# EAGLE board Max10-Brd-v1 (EAGLE 9.2.2), part 1 of 2
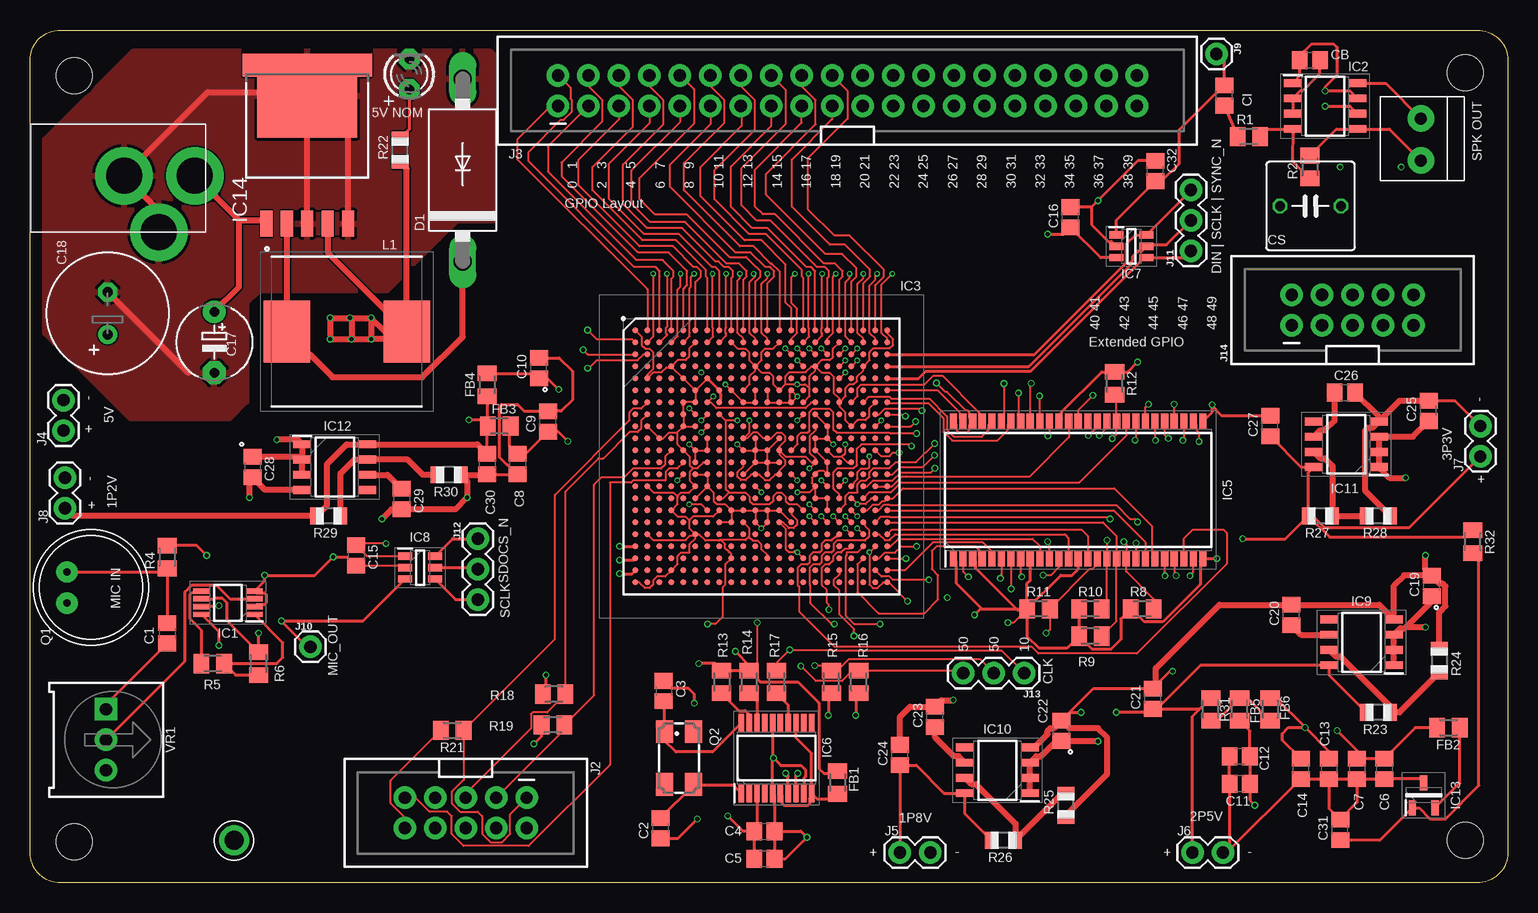
[diagram p7: board, top side]
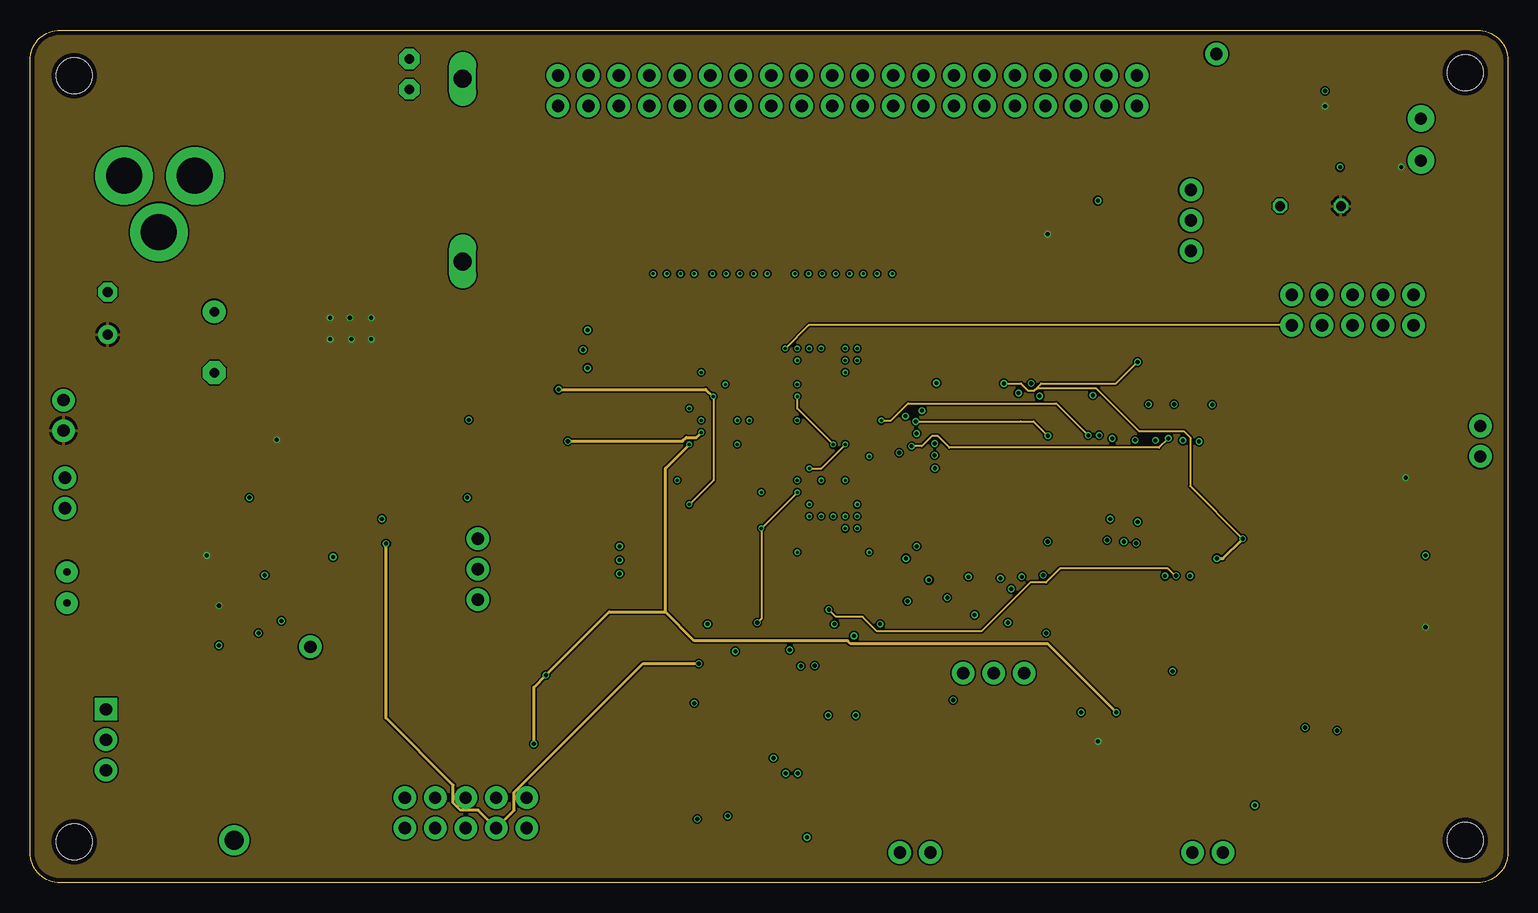
[diagram p8: board, inner layer Route2]
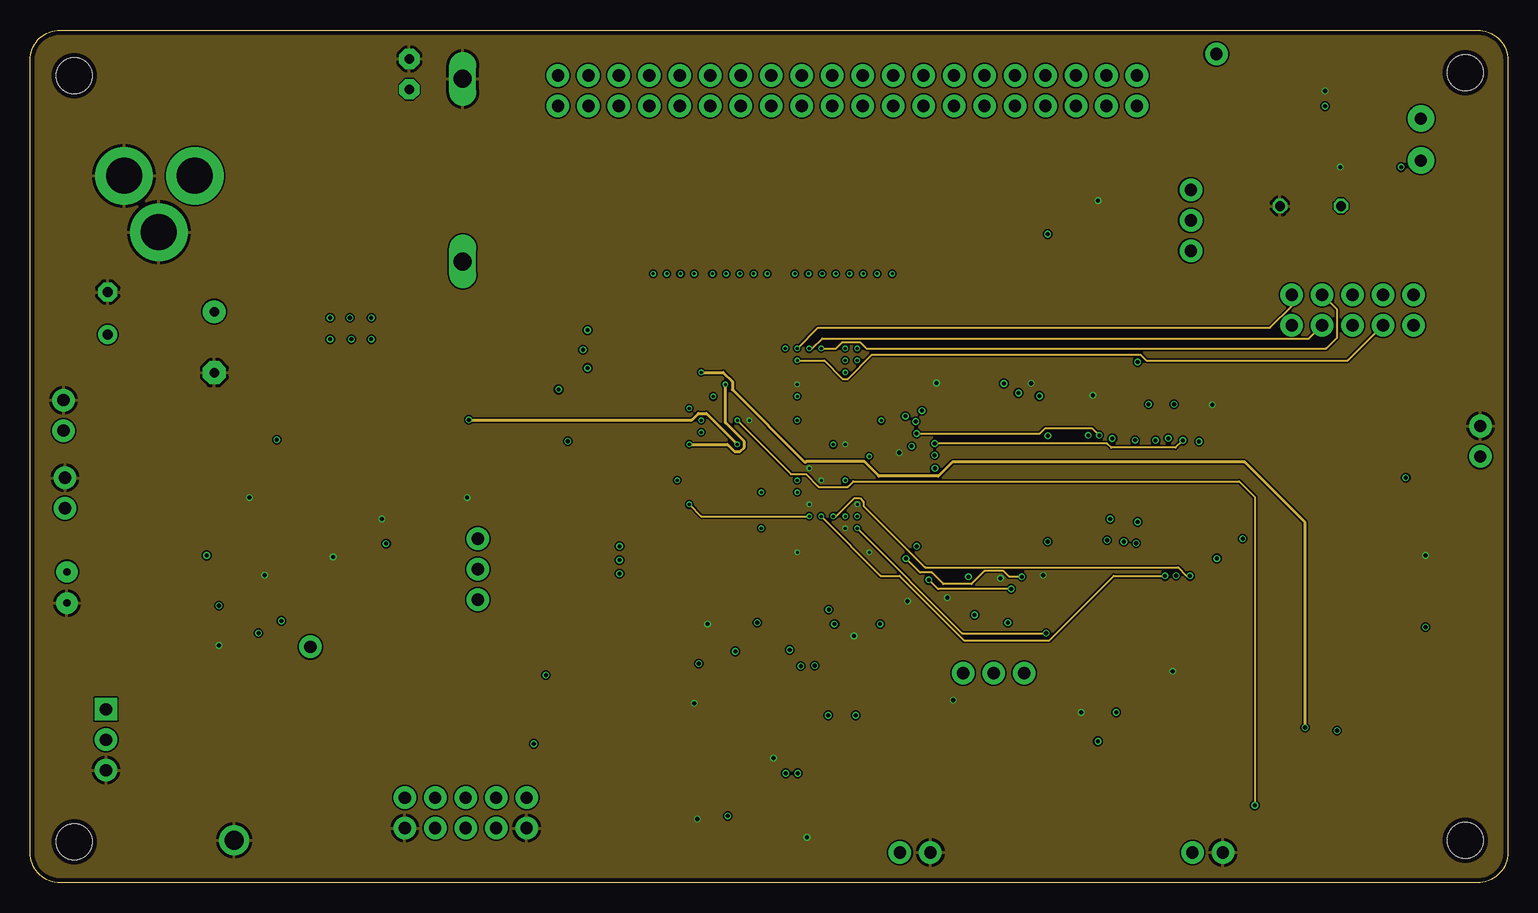
[diagram p9: board, inner layer Route15]
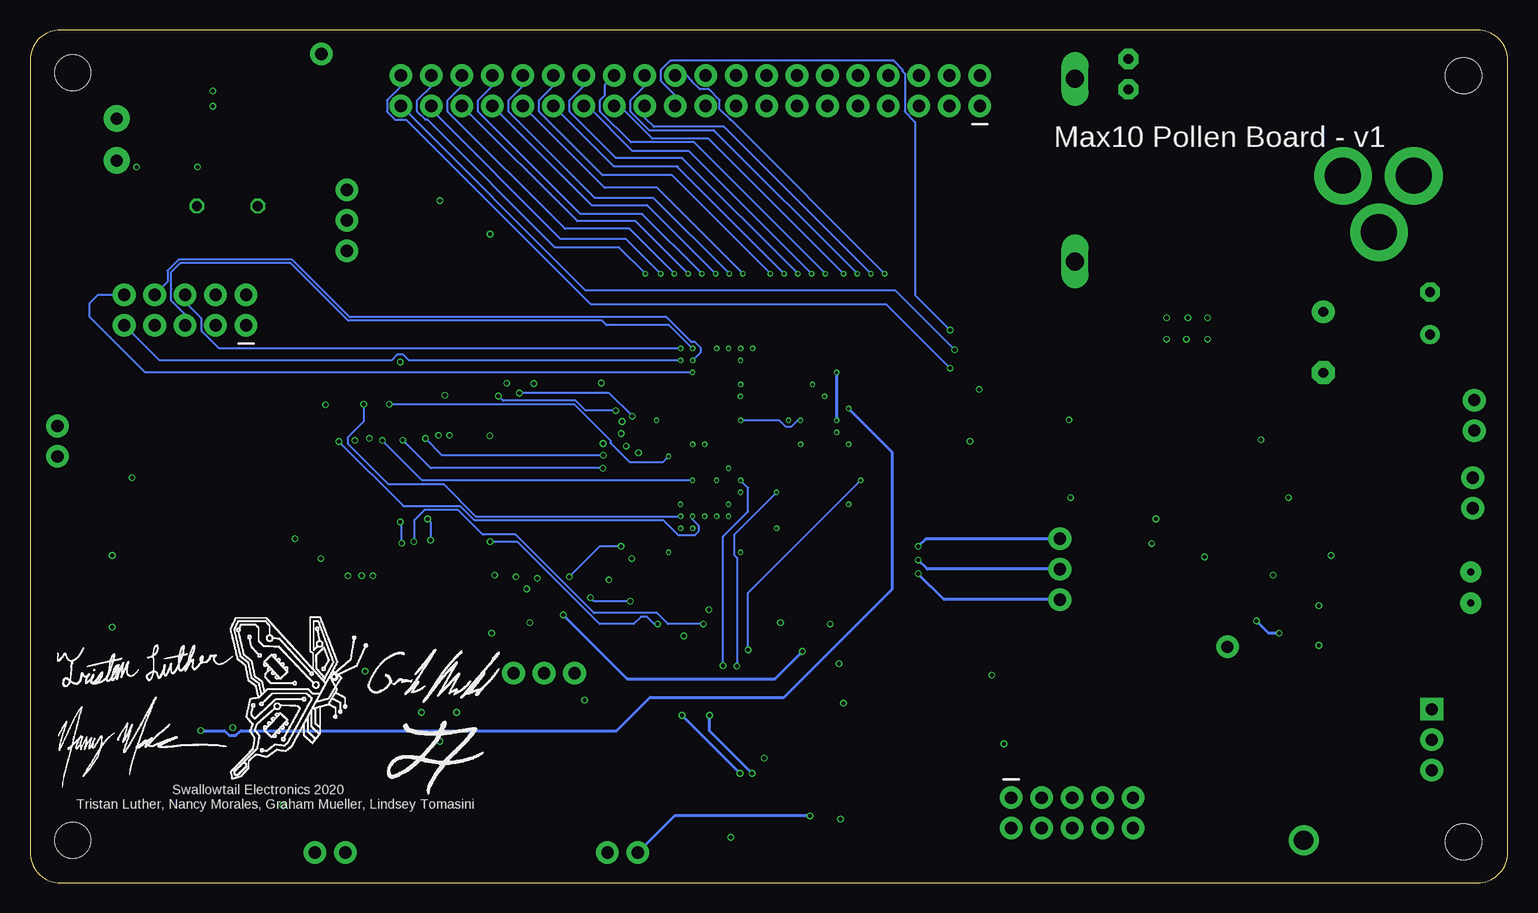
[diagram p10: board, bottom side, seen from below]

Size 123.19 x 71.12 mm. Coordinates in mm from the lower left corner, seen from the top.
Outline: 2.54,71.12 120.65,71.12 arc-90 123.19,68.58 123.19,2.54 arc-90 120.65,0 2.54,0 arc-90 0,2.54 0,68.58 arc-90 2.54,71.12
Copper layers (1*2*15*16): Top 0.035559375mm / dielectric 0.17018125mm / Route2 0.01778125mm / dielectric 47mil / Route15 0.01778125mm / dielectric 0.17018125mm / Bottom 0.035559375mm
Design rules "oshpark-4layer": minimum track width 5mil, minimum drill 10mil, track to track 5mil, track to pad 5mil, pad to pad 5mil, via to via 5mil, smd to smd 5mil, copper to edge 15mil, drill to drill 6mil, minimum pad ring 4mil, minimum via ring 4mil, stop-mask expansion 2.5mil, vias tented up to drill 0mil, thermal gap 10mil
Holes 3 mm at 119.63,3.56 119.63,67.56 3.68,3.43 3.68,67.31

## Footprints (pad centres in the part's own frame; a part is rotated, then mirrored left to right if it is on the bottom)
C0805 = smd 1.3 x 1.5: 1 -0.85,0; 2 0.85,0
E5-6 = drill 0.813 pad 1.905: + -2.54,0 | drill 0.813 pad 1.905 octagon: - 2.54,0
E3,5-10 = drill 0.813 pad 1.6: + -1.778,0 | drill 0.813 pad 1.6 octagon: - 1.778,0
C050-075X075 = drill 0.813 octagon: 1 -2.54,0; 2 2.54,0
DO201-15 = drill 1.499 long: A 7.62,0; C -7.62,0
M0805 = smd 1.3 x 1.6: 1 -0.95,0; 2 0.95,0
SOP65P490X110-8N = smd 1.4 x 0.45: 1 -2.2,0.975; 2 -2.2,0.325; 3 -2.2,-0.325; 4 -2.2,-0.975; 5 2.2,-0.975; 6 2.2,-0.325; 7 2.2,0.325; 8 2.2,0.975
SOIC127P600X175-8N = smd 1.5 x 0.65: 1 -2.7,1.905; 2 -2.7,0.635; 3 -2.7,-0.635; 4 -2.7,-1.905; 5 2.7,-1.905; 6 2.7,-0.635; 7 2.7,0.635; 8 2.7,1.905
BGA484C100P22X22_2300X2300X200 = smd 0.5 x 0.5: A1 -10.5,10.5; A2 -9.5,10.5; A3 -8.5,10.5; A4 -7.5,10.5; A5 -6.5,10.5; A6 -5.5,10.5; A7 -4.5,10.5; A8 -3.5,10.5; A9 -2.5,10.5; A10 -1.5,10.5; A11 -0.5,10.5; A12 0.5,10.5; A13 1.5,10.5; A14 2.5,10.5; A15 3.5,10.5; A16 4.5,10.5; A17 5.5,10.5; A18 6.5,10.5; A19 7.5,10.5; A20 8.5,10.5; A21 9.5,10.5; A22 10.5,10.5; AA1 -10.5,-9.5; AA2 -9.5,-9.5; AA3 -8.5,-9.5; AA4 -7.5,-9.5; AA5 -6.5,-9.5; AA6 -5.5,-9.5; AA7 -4.5,-9.5; AA8 -3.5,-9.5; AA9 -2.5,-9.5; AA10 -1.5,-9.5; AA11 -0.5,-9.5; AA12 0.5,-9.5; AA13 1.5,-9.5; AA14 2.5,-9.5; AA15 3.5,-9.5; AA16 4.5,-9.5; AA17 5.5,-9.5; AA18 6.5,-9.5; AA19 7.5,-9.5; AA20 8.5,-9.5; AA21 9.5,-9.5; AA22 10.5,-9.5; AB1 -10.5,-10.5; AB2 -9.5,-10.5; AB3 -8.5,-10.5; AB4 -7.5,-10.5; AB5 -6.5,-10.5; AB6 -5.5,-10.5; AB7 -4.5,-10.5; AB8 -3.5,-10.5; AB9 -2.5,-10.5; AB10 -1.5,-10.5; AB11 -0.5,-10.5; AB12 0.5,-10.5; AB13 1.5,-10.5; AB14 2.5,-10.5; AB15 3.5,-10.5; AB16 4.5,-10.5; AB17 5.5,-10.5; AB18 6.5,-10.5; AB19 7.5,-10.5; AB20 8.5,-10.5; AB21 9.5,-10.5; AB22 10.5,-10.5; B1 -10.5,9.5; B2 -9.5,9.5; B3 -8.5,9.5; B4 -7.5,9.5; B5 -6.5,9.5; B6 -5.5,9.5; B7 -4.5,9.5; B8 -3.5,9.5; B9 -2.5,9.5; B10 -1.5,9.5; B11 -0.5,9.5; B12 0.5,9.5; B13 1.5,9.5; B14 2.5,9.5; B15 3.5,9.5; B16 4.5,9.5; B17 5.5,9.5; B18 6.5,9.5; B19 7.5,9.5; B20 8.5,9.5; B21 9.5,9.5; B22 10.5,9.5; C1 -10.5,8.5; C2 -9.5,8.5; C3 -8.5,8.5; C4 -7.5,8.5; C5 -6.5,8.5; C6 -5.5,8.5; C7 -4.5,8.5; C8 -3.5,8.5; C9 -2.5,8.5; C10 -1.5,8.5; C11 -0.5,8.5; C12 0.5,8.5; C13 1.5,8.5; C14 2.5,8.5; C15 3.5,8.5; C16 4.5,8.5; C17 5.5,8.5; C18 6.5,8.5; C19 7.5,8.5; C20 8.5,8.5; C21 9.5,8.5; C22 10.5,8.5; D1 -10.5,7.5; D2 -9.5,7.5; D3 -8.5,7.5; D4 -7.5,7.5; D5 -6.5,7.5; D6 -5.5,7.5; D7 -4.5,7.5; D8 -3.5,7.5; D9 -2.5,7.5; D10 -1.5,7.5; D11 -0.5,7.5; D12 0.5,7.5; D13 1.5,7.5; D14 2.5,7.5; D15 3.5,7.5; D16 4.5,7.5; D17 5.5,7.5; D18 6.5,7.5; D19 7.5,7.5; D20 8.5,7.5; D21 9.5,7.5; D22 10.5,7.5; E1 -10.5,6.5; E2 -9.5,6.5; E3 -8.5,6.5; E4 -7.5,6.5; E5 -6.5,6.5; E6 -5.5,6.5; E7 -4.5,6.5; E8 -3.5,6.5; E9 -2.5,6.5; E10 -1.5,6.5; E11 -0.5,6.5; E12 0.5,6.5; E13 1.5,6.5; E14 2.5,6.5; E15 3.5,6.5; E16 4.5,6.5; E17 5.5,6.5; E18 6.5,6.5; E19 7.5,6.5; E20 8.5,6.5; E21 9.5,6.5; E22 10.5,6.5; F1 -10.5,5.5; F2 -9.5,5.5; F3 -8.5,5.5; F4 -7.5,5.5; F5 -6.5,5.5; F6 -5.5,5.5; F7 -4.5,5.5; F8 -3.5,5.5; F9 -2.5,5.5; F10 -1.5,5.5; F11 -0.5,5.5; F12 0.5,5.5; F13 1.5,5.5; F14 2.5,5.5; F15 3.5,5.5; F16 4.5,5.5; F17 5.5,5.5; F18 6.5,5.5; F19 7.5,5.5; F20 8.5,5.5; F21 9.5,5.5; F22 10.5,5.5; G1 -10.5,4.5; G2 -9.5,4.5; G3 -8.5,4.5; G4 -7.5,4.5; G5 -6.5,4.5; G6 -5.5,4.5; G7 -4.5,4.5; G8 -3.5,4.5; G9 -2.5,4.5; G10 -1.5,4.5; G11 -0.5,4.5; G12 0.5,4.5; G13 1.5,4.5; G14 2.5,4.5; G15 3.5,4.5; G16 4.5,4.5; G17 5.5,4.5; G18 6.5,4.5; G19 7.5,4.5; G20 8.5,4.5; G21 9.5,4.5; G22 10.5,4.5; H1 -10.5,3.5; H2 -9.5,3.5; H3 -8.5,3.5; H4 -7.5,3.5; H5 -6.5,3.5; H6 -5.5,3.5; H7 -4.5,3.5; H8 -3.5,3.5; H9 -2.5,3.5; H10 -1.5,3.5; H11 -0.5,3.5; H12 0.5,3.5; H13 1.5,3.5; H14 2.5,3.5; H15 3.5,3.5; H16 4.5,3.5; H17 5.5,3.5; H18 6.5,3.5; H19 7.5,3.5; H20 8.5,3.5; H21 9.5,3.5; H22 10.5,3.5; J1 -10.5,2.5; J2 -9.5,2.5; J3 -8.5,2.5; J4 -7.5,2.5; J5 -6.5,2.5; J6 -5.5,2.5; J7 -4.5,2.5; J8 -3.5,2.5; J9 -2.5,2.5; J10 -1.5,2.5; J11 -0.5,2.5; J12 0.5,2.5; J13 1.5,2.5; J14 2.5,2.5; J15 3.5,2.5; J16 4.5,2.5; J17 5.5,2.5; J18 6.5,2.5; J19 7.5,2.5; J20 8.5,2.5; J21 9.5,2.5; J22 10.5,2.5; K1 -10.5,1.5; K2 -9.5,1.5; K3 -8.5,1.5; K4 -7.5,1.5; K5 -6.5,1.5; K6 -5.5,1.5; K7 -4.5,1.5; K8 -3.5,1.5; K9 -2.5,1.5; K10 -1.5,1.5; K11 -0.5,1.5; K12 0.5,1.5; K13 1.5,1.5; K14 2.5,1.5; K15 3.5,1.5; K16 4.5,1.5; K17 5.5,1.5; K18 6.5,1.5; K19 7.5,1.5; K20 8.5,1.5; K21 9.5,1.5; K22 10.5,1.5; L1 -10.5,0.5; L2 -9.5,0.5; L3 -8.5,0.5; L4 -7.5,0.5; L5 -6.5,0.5; L6 -5.5,0.5; L7 -4.5,0.5; L8 -3.5,0.5; L9 -2.5,0.5; L10 -1.5,0.5; L11 -0.5,0.5; L12 0.5,0.5; L13 1.5,0.5; L14 2.5,0.5; L15 3.5,0.5; L16 4.5,0.5; L17 5.5,0.5; L18 6.5,0.5; L19 7.5,0.5; L20 8.5,0.5; L21 9.5,0.5; L22 10.5,0.5; M1 -10.5,-0.5; M2 -9.5,-0.5; M3 -8.5,-0.5; M4 -7.5,-0.5; M5 -6.5,-0.5; M6 -5.5,-0.5; M7 -4.5,-0.5; M8 -3.5,-0.5; M9 -2.5,-0.5; M10 -1.5,-0.5; M11 -0.5,-0.5; M12 0.5,-0.5; M13 1.5,-0.5; M14 2.5,-0.5; M15 3.5,-0.5; M16 4.5,-0.5; M17 5.5,-0.5; M18 6.5,-0.5; M19 7.5,-0.5; M20 8.5,-0.5; M21 9.5,-0.5; M22 10.5,-0.5; N1 -10.5,-1.5; N2 -9.5,-1.5; N3 -8.5,-1.5; N4 -7.5,-1.5; N5 -6.5,-1.5; N6 -5.5,-1.5; N7 -4.5,-1.5; N8 -3.5,-1.5; N9 -2.5,-1.5; N10 -1.5,-1.5; N11 -0.5,-1.5; N12 0.5,-1.5; N13 1.5,-1.5; N14 2.5,-1.5; N15 3.5,-1.5; N16 4.5,-1.5; N17 5.5,-1.5; N18 6.5,-1.5; N19 7.5,-1.5; N20 8.5,-1.5; N21 9.5,-1.5; N22 10.5,-1.5; P1 -10.5,-2.5; P2 -9.5,-2.5; P3 -8.5,-2.5; P4 -7.5,-2.5; P5 -6.5,-2.5; P6 -5.5,-2.5; P7 -4.5,-2.5; P8 -3.5,-2.5; P9 -2.5,-2.5; P10 -1.5,-2.5; P11 -0.5,-2.5; P12 0.5,-2.5; P13 1.5,-2.5; P14 2.5,-2.5; P15 3.5,-2.5; P16 4.5,-2.5; P17 5.5,-2.5; P18 6.5,-2.5; P19 7.5,-2.5; P20 8.5,-2.5; P21 9.5,-2.5; P22 10.5,-2.5; R1 -10.5,-3.5; R2 -9.5,-3.5; R3 -8.5,-3.5; R4 -7.5,-3.5; R5 -6.5,-3.5; R6 -5.5,-3.5; R7 -4.5,-3.5; R8 -3.5,-3.5; R9 -2.5,-3.5; R10 -1.5,-3.5; R11 -0.5,-3.5; R12 0.5,-3.5; R13 1.5,-3.5; R14 2.5,-3.5; R15 3.5,-3.5; R16 4.5,-3.5; R17 5.5,-3.5; R18 6.5,-3.5; R19 7.5,-3.5; R20 8.5,-3.5; R21 9.5,-3.5; R22 10.5,-3.5; T1 -10.5,-4.5; T2 -9.5,-4.5; T3 -8.5,-4.5; T4 -7.5,-4.5; T5 -6.5,-4.5; T6 -5.5,-4.5; T7 -4.5,-4.5; T8 -3.5,-4.5; T9 -2.5,-4.5; T10 -1.5,-4.5; T11 -0.5,-4.5; T12 0.5,-4.5; T13 1.5,-4.5; T14 2.5,-4.5; T15 3.5,-4.5; T16 4.5,-4.5; T17 5.5,-4.5; T18 6.5,-4.5; T19 7.5,-4.5; T20 8.5,-4.5; T21 9.5,-4.5; T22 10.5,-4.5; U1 -10.5,-5.5; U2 -9.5,-5.5; U3 -8.5,-5.5; U4 -7.5,-5.5; U5 -6.5,-5.5; U6 -5.5,-5.5; U7 -4.5,-5.5; U8 -3.5,-5.5; U9 -2.5,-5.5; U10 -1.5,-5.5; U11 -0.5,-5.5; U12 0.5,-5.5; U13 1.5,-5.5; U14 2.5,-5.5; U15 3.5,-5.5; U16 4.5,-5.5; U17 5.5,-5.5; U18 6.5,-5.5; U19 7.5,-5.5; U20 8.5,-5.5; U21 9.5,-5.5; U22 10.5,-5.5; V1 -10.5,-6.5; V2 -9.5,-6.5; V3 -8.5,-6.5; V4 -7.5,-6.5; V5 -6.5,-6.5; V6 -5.5,-6.5; V7 -4.5,-6.5; V8 -3.5,-6.5; V9 -2.5,-6.5; V10 -1.5,-6.5; V11 -0.5,-6.5; V12 0.5,-6.5; V13 1.5,-6.5; V14 2.5,-6.5; V15 3.5,-6.5; V16 4.5,-6.5; V17 5.5,-6.5; V18 6.5,-6.5; V19 7.5,-6.5; V20 8.5,-6.5; V21 9.5,-6.5; V22 10.5,-6.5; W1 -10.5,-7.5; W2 -9.5,-7.5; W3 -8.5,-7.5; W4 -7.5,-7.5; W5 -6.5,-7.5; W6 -5.5,-7.5; W7 -4.5,-7.5; W8 -3.5,-7.5; W9 -2.5,-7.5; W10 -1.5,-7.5; W11 -0.5,-7.5; W12 0.5,-7.5; W13 1.5,-7.5; W14 2.5,-7.5; W15 3.5,-7.5; W16 4.5,-7.5; W17 5.5,-7.5; W18 6.5,-7.5; W19 7.5,-7.5; W20 8.5,-7.5; W21 9.5,-7.5; W22 10.5,-7.5; Y1 -10.5,-8.5; Y2 -9.5,-8.5; Y3 -8.5,-8.5; Y4 -7.5,-8.5; Y5 -6.5,-8.5; Y6 -5.5,-8.5; Y7 -4.5,-8.5; Y8 -3.5,-8.5; Y9 -2.5,-8.5; Y10 -1.5,-8.5; Y11 -0.5,-8.5; Y12 0.5,-8.5; Y13 1.5,-8.5; Y14 2.5,-8.5; Y15 3.5,-8.5; Y16 4.5,-8.5; Y17 5.5,-8.5; Y18 6.5,-8.5; Y19 7.5,-8.5; Y20 8.5,-8.5; Y21 9.5,-8.5; Y22 10.5,-8.5
SOP80P1176X120-54N = smd 1.295 x 0.6: 1 -5.728,10.4; 2 -5.728,9.6; 3 -5.728,8.8; 4 -5.728,8; 5 -5.728,7.2; 6 -5.728,6.4; 7 -5.728,5.6; 8 -5.728,4.8; 9 -5.728,4; 10 -5.728,3.2; 11 -5.728,2.4; 12 -5.728,1.6; 13 -5.728,0.8; 14 -5.728,0; 15 -5.728,-0.8; 16 -5.728,-1.6; 17 -5.728,-2.4; 18 -5.728,-3.2; 19 -5.728,-4; 20 -5.728,-4.8; 21 -5.728,-5.6; 22 -5.728,-6.4; 23 -5.728,-7.2; 24 -5.728,-8; 25 -5.728,-8.8; 26 -5.728,-9.6; 27 -5.728,-10.4; 28 5.728,-10.4; 29 5.728,-9.6; 30 5.728,-8.8; 31 5.728,-8; 32 5.728,-7.2; 33 5.728,-6.4; 34 5.728,-5.6; 35 5.728,-4.8; 36 5.728,-4; 37 5.728,-3.2; 38 5.728,-2.4; 39 5.728,-1.6; 40 5.728,-0.8; 41 5.728,0; 42 5.728,0.8; 43 5.728,1.6; 44 5.728,2.4; 45 5.728,3.2; 46 5.728,4; 47 5.728,4.8; 48 5.728,5.6; 49 5.728,6.4; 50 5.728,7.2; 51 5.728,8; 52 5.728,8.8; 53 5.728,9.6; 54 5.728,10.4
SOP65P640X120-20N = smd 1.475 x 0.45: 1 -2.938,2.925; 2 -2.938,2.275; 3 -2.938,1.625; 4 -2.938,0.975; 5 -2.938,0.325; 6 -2.938,-0.325; 7 -2.938,-0.975; 8 -2.938,-1.625; 9 -2.938,-2.275; 10 -2.938,-2.925; 11 2.938,-2.925; 12 2.938,-2.275; 13 2.938,-1.625; 14 2.938,-0.975; 15 2.938,-0.325; 16 2.938,0.325; 17 2.938,0.975; 18 2.938,1.625; 19 2.938,2.275; 20 2.938,2.925
SOT95P280X145-6N = smd 1.15 x 0.6: 1 -1.25,0.95; 2 -1.25,0; 3 -1.25,-0.95; 4 1.25,-0.95; 5 1.25,0; 6 1.25,0.95
SOT95P237X112-3N = smd 1.25 x 0.6: 1 -1.05,0.95; 2 -1.05,-0.95; 3 1.05,0
KTT0005B = smd 2.16 x 1.02: 1 12.461,-3.4; 2 12.461,-1.7; 3 12.461,0; 4 12.461,1.7; 5 12.461,3.4 | smd 6.99 x 8.33: 6 1.786,0 | smd 1.91 x 1.235: 7 -0.754,4.782; 8 -0.754,-4.782
1X2-3.5MM = drill 1 pad 2.184: 1 1.8,0; 2 -1.7,0
2X5-SHROUDED = drill 1.016 pad 1.88: 1 -1.27,5.08; 2 1.27,5.08; 3 -1.27,2.54; 4 1.27,2.54; 5 -1.27,0; 6 1.27,0; 7 -1.27,-2.54; 8 1.27,-2.54; 9 -1.27,-5.08; 10 1.27,-5.08
2X20_SHROUDED = drill 1.016 pad 1.88: 1 -1.27,24.13; 2 1.27,24.13; 3 -1.27,21.59; 4 1.27,21.59; 5 -1.27,19.05; 6 1.27,19.05; 7 -1.27,16.51; 8 1.27,16.51; 9 -1.27,13.97; 10 1.27,13.97; 11 -1.27,11.43; 12 1.27,11.43; 13 -1.27,8.89; 14 1.27,8.89; 15 -1.27,6.35; 16 1.27,6.35; 17 -1.27,3.81; 18 1.27,3.81; 19 -1.27,1.27; 20 1.27,1.27; 21 -1.27,-1.27; 22 1.27,-1.27; 23 -1.27,-3.81; 24 1.27,-3.81; 25 -1.27,-6.35; 26 1.27,-6.35; 27 -1.27,-8.89; 28 1.27,-8.89; 29 -1.27,-11.43; 30 1.27,-11.43; 31 -1.27,-13.97; 32 1.27,-13.97; 33 -1.27,-16.51; 34 1.27,-16.51; 35 -1.27,-19.05; 36 1.27,-19.05; 37 -1.27,-21.59; 38 1.27,-21.59; 39 -1.27,-24.13; 40 1.27,-24.13
1X02 = drill 1.016 pad 1.88: 1 0,0; 2 2.54,0
1X01 = drill 1.016 pad 1.88: 1 0,0
1X03 = drill 1.016 pad 1.88: 1 0,0; 2 2.54,0; 3 5.08,0
INDPM125125X650N = smd 3.85 x 5.2: 1 -5,0; 2 5,0
LED3MM = drill 0.813 pad 1.676 octagon: A -1.27,0; K 1.27,0
9.7ELECTRET = drill 0.6 pad 1.778: + 1.3,2; - -1.3,2
CTS406 = smd 1.9 x 1.4: 1 -2.2,-1.2; 2 2.2,-1.2; 3 2.2,1.2; 4 -2.2,1.2
R0805 = smd 1.1 x 1.4: 1 -1,0; 2 1,0
TEST_POINT = drill 1.6 pad 2.5: TP1 0,0
PJ-102A = drill 3 pad 4.8: RING 0.1,-3.39; RING_SW -4.6,-6.29; TIP 0.1,-9.29
TRIMPOT-PTH-3386U = drill 1.016 pad 1.88 square: 1 -2.54,-0.015 | drill 1.016 pad 1.88: 2 0,-0.015; 3 2.54,-0.015

## Placement (x,y rotation side)
C1  0.1uF  [C0805]  11.43,20.83 270 top
C2  4pF  [C0805]  52.58,4.57 90 top
C3  4pF  [C0805]  52.83,16 270 top
C4  0.01uF  [C0805]  61.21,4.32 0 top
C5  1nF  [C0805]  61.21,2.03 0 top
C6  10uF  [C0805]  112.89,9.52 270 top
C7  1uF  [C0805]  110.62,9.52 270 top
C8  10uF  [C0805]  40.64,34.92 270 top
C9  1uF  [C0805]  43.18,38.48 90 top
C10  4.7uF  [C0805]  42.42,42.93 90 top
C11  10uF  [C0805]  100.84,8.26 180 top
C12  1uF  [C0805]  100.84,10.54 180 top
C13  10uF  [C0805]  108.29,9.52 270 top
C14  1uF  [C0805]  105.92,9.53 270 top
C15  0.01uF  [C0805]  27.18,27.3 270 top
C16  0.01uF  [C0805]  86.74,55.5 90 top
C17  100uF  [E5-6]  15.37,45.09 270 top
C18  1000uF  [E3,5-10]  6.48,47.5 90 top
C19  4.7uF  [C0805]  116.84,24.77 90 top
C20  10nF  [C0805]  105.16,22.35 90 top
C21  1uF  [C0805]  93.6,15.37 90 top
C22  4.7uF  [C0805]  85.98,12.7 90 top
C23  10nF  [C0805]  75.44,13.84 90 top
C24  1uF  [C0805]  72.52,10.67 90 top
C25  4.7uF  [C0805]  116.59,39.37 90 top
C26  10nF  [C0805]  109.6,40.89 0 top
C27  1uF  [C0805]  103.38,38.1 90 top
C28  4.7uF  [C0805]  18.54,34.67 270 top
C29  10nF  [C0805]  30.99,32 270 top
C30  1uF  [C0805]  38.1,34.92 270 top
C31  0.47uF  [C0805]  109.21,4.44 90 top
C32  0.01uF  [C0805]  93.81,59.36 90 top
CB  1uF  [C0805]  106.68,68.58 180 top
CI  0.39uF  [C0805]  99.58,65.66 90 top
CS  1uF Tant  [C050-075X075]  106.74,56.44 180 top
D1  [DO201-15]  36.07,59.44 90 top
FB1  220  [M0805]  67.31,8.38 90 top
FB2  30  [M0805]  118.24,12.95 180 top
FB3  30  [M0805]  39.12,38.1 0 top
FB4  30  [M0805]  38.1,41.53 90 top
FB5  30  [M0805]  100.84,14.48 270 top
FB6  220  [M0805]  103.38,14.48 90 top
IC1  INA332AIDGKR  [SOP65P490X110-8N]  16.51,23.37 180 top
IC2  LM4991MAX_NOPB  [SOIC127P600X175-8N]  107.95,64.77 0 top
IC3  10M50DAF484C7G  [BGA484C100P22X22_2300X2300X200]  60.96,35.56 0 top
IC5  IS42S16400J-7TLI  [SOP80P1176X120-54N]  87.38,32.77 90 top
IC6  CDCE937PWRG4  [SOP65P640X120-20N]  62.23,10.41 90 top
IC7  AD5320BRTZ  [SOT95P280X145-6N]  91.82,53.09 0 top
IC8  ADS7868IDBVR  [SOT95P280X145-6N]  32.51,26.29 0 top
IC9  MCP1726T-ADJE_SN  [SOIC127P600X175-8N]  111,20.07 180 top
IC10  MCP1726T-ADJE_SN  [SOIC127P600X175-8N]  80.64,9.4 180 top
IC11  MCP1726T-ADJE_SN  [SOIC127P600X175-8N]  109.73,36.58 180 top
IC12  MCP1726T-ADJE_SN  [SOIC127P600X175-8N]  25.4,34.67 0 top
IC13  REF3125AQDBZRQ1  [SOT95P237X112-3N]  116.17,7.31 90 top
IC14  LM2576HVS-ADJ  [KTT0005B]  23.11,67.44 270 top
J1  1X2-3.5MM  [1X2-3.5MM]  115.96,61.94 90 top
J2  [2X5-SHROUDED]  36.32,5.84 270 top
J3  CONN_20X2SHROUDED  [2X20_SHROUDED]  68.14,66.06 90 top
J4  [1X02]  2.79,37.72 90 top
J5  [1X02]  72.52,2.54 0 top
J6  [1X02]  96.9,2.54 0 top
J7  [1X02]  120.9,35.56 90 top
J8  [1X02]  2.92,31.24 90 top
J9  [1X01]  98.9,69.12 0 top
J10  [1X01]  23.37,19.68 0 top
J11  [1X03]  96.77,57.78 270 top
J12  [1X03]  37.34,28.7 270 top
J13  [1X03]  77.8,17.5 0 top
J14  [2X5-SHROUDED]  110.26,47.77 90 top
L1  100uH  [INDPM125125X650N]  26.42,45.97 0 top
LED1  [LED3MM]  31.62,67.44 90 top
Q1  [9.7ELECTRET]  5.08,24.64 90 top
Q2  24MHz  [CTS406]  54.1,10.41 270 top
R1  20k  [M0805]  101.6,62.23 0 top
R2  20k  [M0805]  106.68,59.69 90 top
R4  2.2k  [M0805]  11.43,27.18 90 top
R5  2.2k  [M0805]  15.24,18.29 0 top
R6  2.2k  [M0805]  19.05,18.29 90 top
R8  4.7k  [M0805]  92.71,22.86 0 top
R9  4.7k  [M0805]  88.39,20.57 0 top
R10  4.7k  [M0805]  88.39,22.86 0 top
R11  4.7k  [M0805]  84.07,22.86 0 top
R12  4.7k  [M0805]  90.42,41.66 270 top
R13  4.7k  [M0805]  57.66,16.76 90 top
R14  4.7k  [M0805]  59.94,16.76 90 top
R15  18.2  [M0805]  66.8,16.76 270 top
R16  18.2  [M0805]  69.09,16.76 270 top
R17  18.2  [M0805]  62.23,16.76 90 top
R18  10k  [M0805]  43.68,15.74 0 top
R19  10k  [M0805]  43.6,13.19 0 top
R21  1k  [M0805]  35.2,12.72 180 top
R22  220  [R0805]  30.86,61.09 90 top
R23  510k  [R0805]  112.39,14.22 180 top
R24  100k  [R0805]  117.47,18.54 270 top
R25  150k  [R0805]  86.36,6.48 90 top
R26  510k  [R0805]  81.15,3.56 180 top
R27  86k  [R0805]  107.57,30.61 180 top
R28  12k  [R0805]  112.39,30.61 180 top
R29  40k  [R0805]  24.89,30.61 180 top
R30  20k  [R0805]  34.92,34.04 180 top
R31  0.4  [M0805]  98.42,14.48 270 top
R32  0.4  [M0805]  120.27,28.45 270 top
TP$1  TEST_POINT  [TEST_POINT]  17.02,3.56 0 top
U$1  2.1MMJACKTHM  [PJ-102A]  4.45,58.86 90 top
U$2  [GRAHAM_SIGNATURE_BPLACE]  83.68,14.89 90 bottom
U$3  [NANCY_SIGNATURE_BPLACE]  106.81,6.37 90 bottom
U$4  [LINDSEY_SIGNATURE_BPLACE]  85.04,13.77 270 top
U$5  [TRISTAN_SIGNATURE_BPLACE]  121.87,16.11 0 bottom
U$6  [SWALLOWTAIL_NO_TEXT_BACK]  107.59,8.44 0 bottom
VR1  10k  [TRIMPOT-PTH-3386U]  6.35,11.94 270 top